# Altium project O_Punch_PCB.PrjPcb
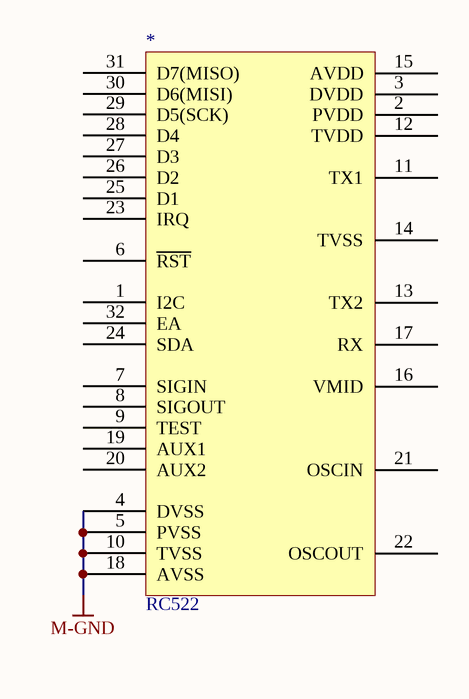
[diagram p0: RC522.SchDoc]
1 sheet, 1 parts. Net scope: global (net labels, ports and power ports of the same name join across sheets).
Board file: O_PCB.PcbDoc

## Sheet RC522.SchDoc
size A4

### Parts
*  RC522  [QFN32-N]

### Nets
M-GND: *.4(DVSS) *.5(PVSS) *.10(TVSS) *.18(AVSS)

Not connected (* = marked no-connect by the designer): * 1(I2C) 2(PVDD) 3(DVDD) 6(~{RST}) 7(SIGIN) 8(SIGOUT) 9(TEST) 11(TX1) 12(TVDD) 13(TX2) 14(TVSS) 15(AVDD) 16(VMID) 17(RX) 19(AUX1) 20(AUX2) 21(OSCIN) 22(OSCOUT) 23(IRQ) 24(SDA) 25(D1) 26(D2) 27(D3) 28(D4) 29(D5(SCK)) 30(D6(MISI)) 31(D7(MISO)) 32(EA)